# Altium schematic sheet MCU.SchDoc
size A4
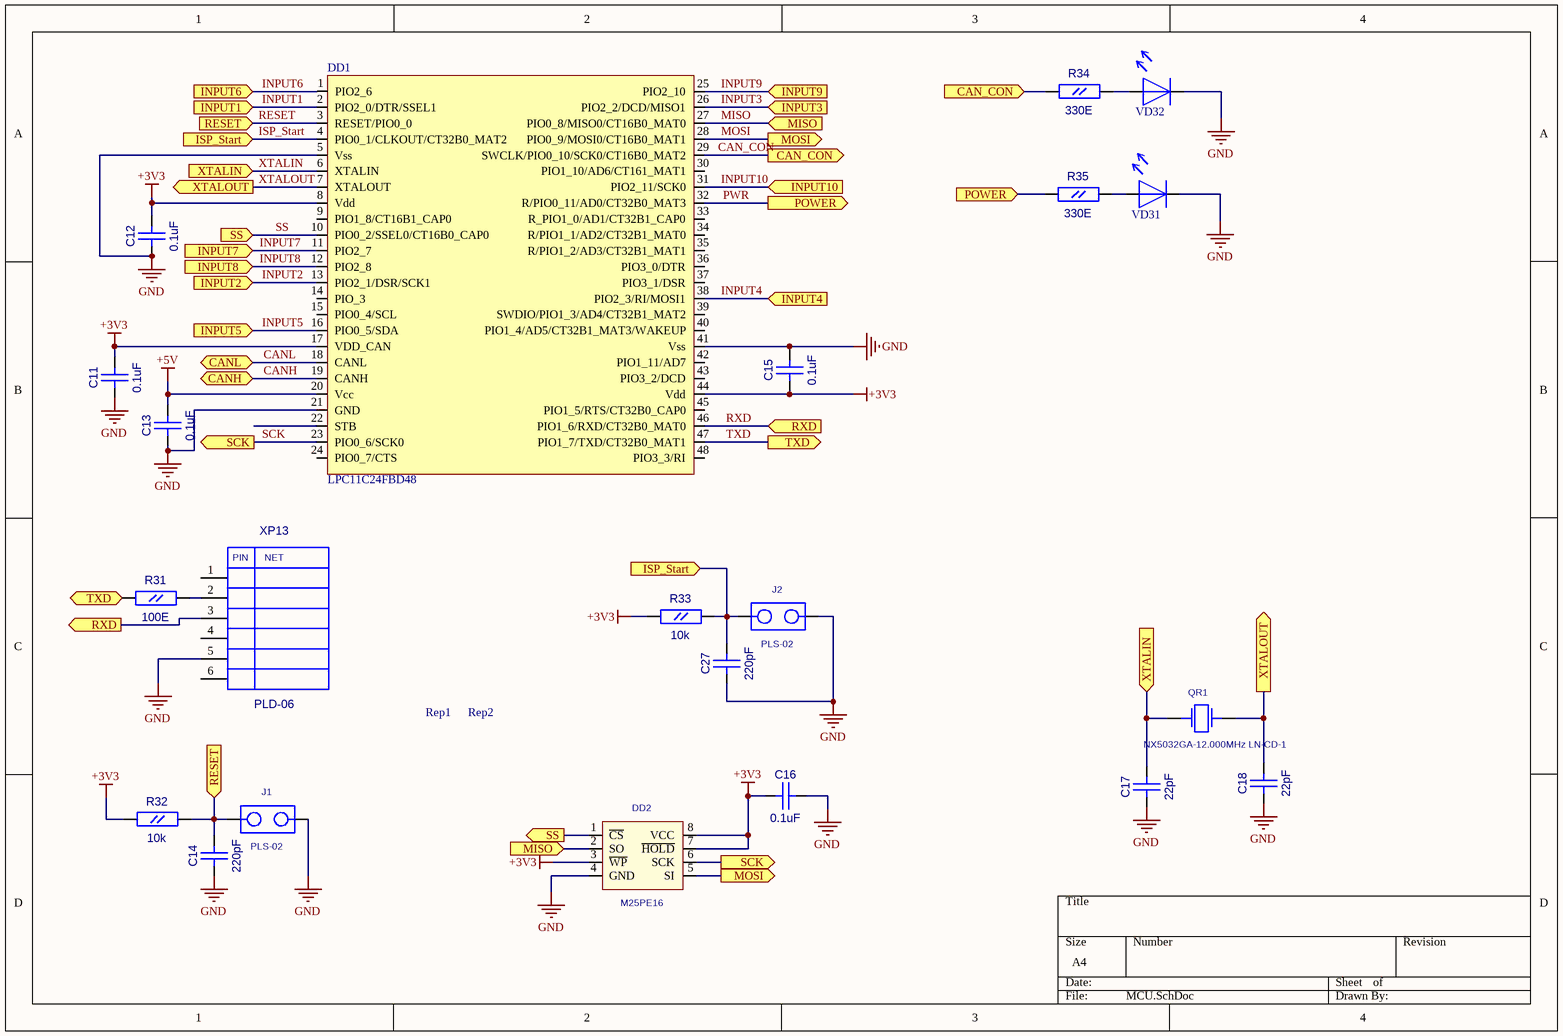
[diagram p0: MCU.SchDoc]

## Parts
C11  0.1uF  [CC0603]
C12  0.1uF  [CC0603]
C13  0.1uF  [CC0603]
C14  220pF  [CC0603]
C15  0.1uF  [CC0603]
C16  0.1uF  [CC0603]
C17  22pF  [CC0603]
C18  22pF  [CC0603]
C27  220pF  [CC0603]
DD1  LPC11C24FBD48  [LQFP-48]
DD2  M25PE16  [EIAJ_SO8]
J1  PLS-02  [PIN2W]
J2  PLS-02  [PIN2W]
QR1  NX5032GA-12.000MHz LN-CD-1  [AC5032_2]
R31  100E  [RC0603]
R32  10k  [RC0603]
R33  10k  [RC0603]
R34  330E  [RC0603]
R35  330E  [RC0603]
Rep1  REPER1.2  [REPER1.2]  (value not drawn)
Rep2  REPER1.2  [REPER1.2]  (value not drawn)
VD31  BL-HS135A-TRB  [LED0805]  (value not drawn)
VD32  BL-HG035A-TRB  [LED0805]  (value not drawn)
XP13  PLD-06  [PIN6]

## Ports
CAN_CON (in), CAN_CON (out), CANH, CANL, INPUT1 (in), INPUT2 (in), INPUT3 (in), INPUT4 (in), INPUT5 (in), INPUT6 (in), INPUT7 (in), INPUT8 (in), INPUT9 (in), INPUT10 (in), ISP_Start (in), MISO (in), MOSI (out), POWER (in), POWER (out), RESET (in), RXD (in), RXD (out), SCK (out), SS (in), SS (out), TXD (in), TXD (out), XTALIN (in), XTALOUT (out)

## Nets
+3V3: C11.2(B) C12.2(B) C15.1(A) C16.1(A) DD1.8(Vdd) DD1.17(VDD_CAN) DD1.44(Vdd) DD2.3(~{WP}) DD2.7(~{HOLD}) DD2.8(VCC) R32.1(A) R33.1(A)
+5V: C13.2(B) DD1.20(Vcc)
GND: C11.1(A) C12.1(A) C13.1(A) C14.1(A) C15.2(B) C16.2(B) C17.1(A) C18.1(A) C27.1(A) DD1.5(Vss) DD1.21(GND) DD1.41(Vss) DD2.4(GND) J1.2 J2.2 VD31.2 VD32.2 XP13.5
CAN_CON: DD1.29(SWCLK/PIO0_10/SCK0/CT16B0_MAT2) R34.1(A) ; port CAN_CON
CANH: DD1.19(CANH) ; port CANH
CANL: DD1.18(CANL) ; port CANL
INPUT1: DD1.2(PIO2_0/DTR/SSEL1) ; port INPUT1
INPUT2: DD1.13(PIO2_1/DSR/SCK1) ; port INPUT2
INPUT3: DD1.26(PIO2_2/DCD/MISO1) ; port INPUT3
INPUT4: DD1.38(PIO2_3/RI/MOSI1) ; port INPUT4
INPUT5: DD1.16(PIO0_5/SDA) ; port INPUT5
INPUT6: DD1.1(PIO2_6) ; port INPUT6
INPUT7: DD1.11(PIO2_7) ; port INPUT7
INPUT8: DD1.12(PIO2_8) ; port INPUT8
INPUT9: DD1.25(PIO2_10) ; port INPUT9
INPUT10: DD1.31(PIO2_11/SCK0) ; port INPUT10
ISP_Start: C27.2(B) DD1.4(PIO0_1/CLKOUT/CT32B0_MAT2) J2.1 R33.2(B) ; port ISP_Start
MISO: DD1.27(PIO0_8/MISO0/CT16B0_MAT0) DD2.2(SO) ; port MISO
MOSI: DD1.28(PIO0_9/MOSI0/CT16B0_MAT1) DD2.5(SI) ; port MOSI
PWR: DD1.32(R/PIO0_11/AD0/CT32B0_MAT3) R35.1(A) ; port POWER
RESET: C14.2(B) DD1.3(RESET/PIO0_0) J1.1 R32.2(B) ; port RESET
RXD: DD1.46(PIO1_6/RXD/CT32B0_MAT0) XP13.3 ; port RXD
SCK: DD1.23(PIO0_6/SCK0) DD2.6(SCK) ; port SCK
SS: DD1.10(PIO0_2/SSEL0/CT16B0_CAP0) DD2.1(~{CS}) ; port SS
TXD: DD1.47(PIO1_7/TXD/CT32B0_MAT1) R31.1(A) ; port TXD
XTALIN: C17.2(B) DD1.6(XTALIN) QR1.1 ; port XTALIN
XTALOUT: C18.2(B) DD1.7(XTALOUT) QR1.2 ; port XTALOUT
NetR31_2: R31.2(B) XP13.2
NetR34_2: R34.2(B) VD32.1
NetR35_2: R35.2(B) VD31.1

Not connected (* = marked no-connect by the designer): DD1 9(PIO1_8/CT16B1_CAP0) 14(PIO_3) 15(PIO0_4/SCL) 22(STB) 24(PIO0_7/CTS) 30(PIO1_10/AD6/CT161_MAT1) 33(R_PIO1_0/AD1/CT32B1_CAP0) 34(R/PIO1_1/AD2/CT32B1_MAT0) 35(R/PIO1_2/AD3/CT32B1_MAT1) 36(PIO3_0/DTR) 37(PIO3_1/DSR) 39(SWDIO/PIO1_3/AD4/CT32B1_MAT2) 40(PIO1_4/AD5/CT32B1_MAT3/WAKEUP) 42(PIO1_11/AD7) 43(PIO3_2/DCD) 45(PIO1_5/RTS/CT32B0_CAP0) 48(PIO3_3/RI); Rep1 1; Rep2 1; XP13 1 4 6

## Notes on the sheet
- (in symbol PLD-06) PIN; NET

## Library data of the parts
C11-C18 C27 = CC0603
  C11-C13 C15 C16: Value: 0.1uF
  C14 C27: Value: 220pF
  C17 C18: Value: 22pF
DD2 = S25FL016A0LMFI01: Value: M25PE16
QR1 = AC5032_2: AC5032/2; Value: NX5032GA-12.000MHz LN-CD-1
R31-R35 = RC0603
  R31: Value: 100E
  R32 R33: Value: 10k
  R34 R35: Value: 330E
VD31 VD32 = LED_0805
  VD31: Value: BL-HS135A-TRB
  VD32: Value: BL-HG035A-TRB
XP13 = PLD-06: PLD06; Value: *
DD1 = LPC11C24FBD48: Value: LPC11C24FBD48
J1 J2 = PLS-02: Value: *
Rep1 Rep2 = REPER1.2: Value: *